# EAGLE schematic TeklaShieldThroughHole (EAGLE 5.10)
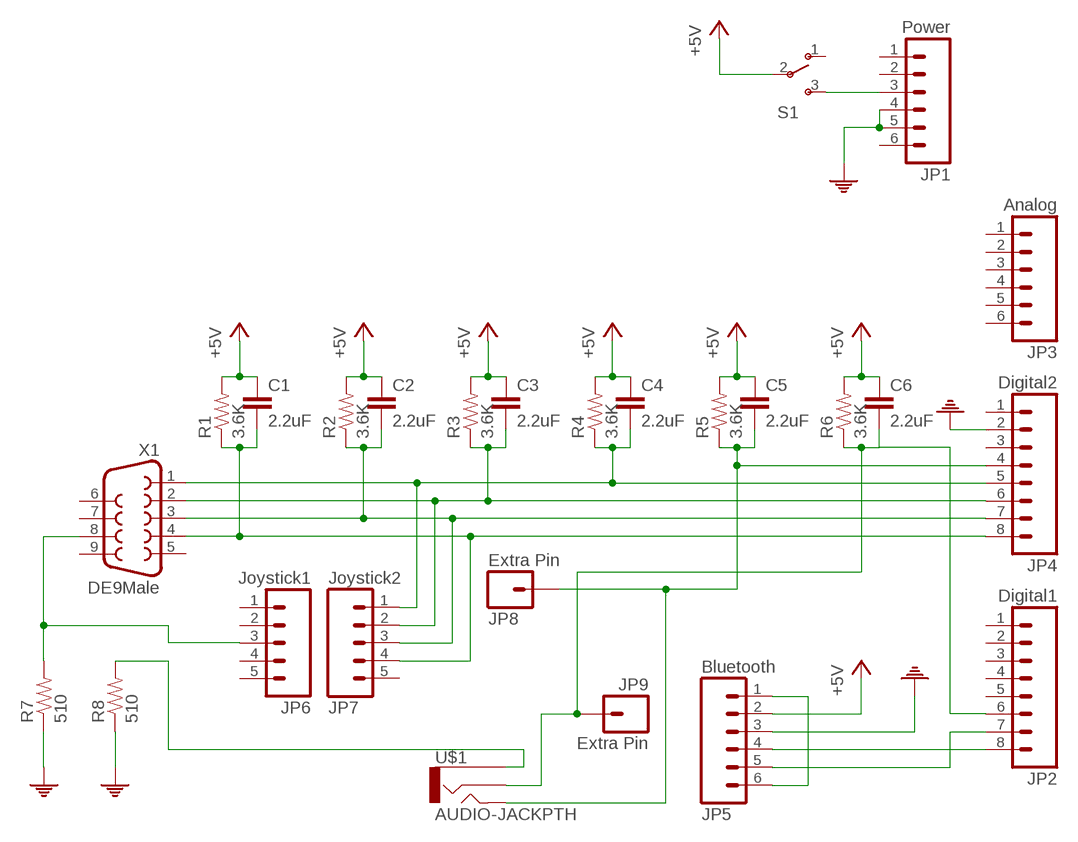
[diagram p0: schematic, sheet 1]

## Parts
C1  2.2uF  CAPPTH  [CAP-PTH-SMALL]
C2  2.2uF  CAPPTH  [CAP-PTH-SMALL]
C3  2.2uF  CAPPTH  [CAP-PTH-SMALL]
C4  2.2uF  CAPPTH  [CAP-PTH-SMALL]
C5  2.2uF  CAPPTH  [CAP-PTH-SMALL]
C6  2.2uF  CAPPTH  [CAP-PTH-SMALL]
JP1  Power  M06SIP  [1X06]
JP2  Digital1  M08  [1X08]
JP3  Analog  M06SIP  [1X06]
JP4  Digital2  M08  [1X08]
JP5  Bluetooth  M06SIP  [1X06]
JP6  Joystick1  M05  [1X05]
JP7  Joystick2  M05  [1X05]
JP8  Extra Pin  M01PTH  [1X01]
JP9  Extra Pin  M01PTH  [1X01]
R1  3.6K  RESISTORPTH1  [AXIAL-0.3]
R2  3.6K  RESISTORPTH1  [AXIAL-0.3]
R3  3.6K  RESISTORPTH1  [AXIAL-0.3]
R4  3.6K  RESISTORPTH1  [AXIAL-0.3]
R5  3.6K  RESISTORPTH1  [AXIAL-0.3]
R6  3.6K  RESISTORPTH1  [AXIAL-0.3]
R7  510  RESISTORPTH1  [AXIAL-0.3]
R8  510  RESISTORPTH1  [AXIAL-0.3]
S1  SWITCH-SPST  [SWITCH-SPST]
U$1  AUDIO-JACKPTH  [AUDIO-JACK]
X1  DE9Male  DB9  [DB9]

## Nets
E1: C5.2 JP4.4 JP8.1 R5.P$1 U$1.5
E2: C6.2 JP2.6 JP9.1 R6.P$1 U$1.2
ECMN: R8.P$2 U$1.1
GND: JP1.4 JP1.5 JP4.2 JP5.3 R7.P$1 R8.P$1
JCMN: JP6.3 R7.P$2 X1.8
N$1: JP2.8 JP5.4
N$2: JP2.7 JP5.5
N$3: JP1.3 S1.3(S)
N$4: JP5.1 JP5.6
S1: C4.2 JP4.5 JP7.1 R4.P$1 X1.1
S2: C3.2 JP4.6 JP7.2 R3.P$1 X1.2
S3: C2.2 JP4.7 JP7.3 R2.P$1 X1.3
S4: C1.2 JP4.8 JP7.4 R1.P$1 X1.4
VCC: C1.1 C2.1 C3.1 C4.1 C5.1 C6.1 JP5.2 R1.P$2 R2.P$2 R3.P$2 R4.P$2 R5.P$2 R6.P$2 S1.2(P) ; supply symbol labelled +5V
Unconnected: JP1.1 JP1.2 JP1.6 JP2.1 JP2.2 JP2.3 JP2.4 JP2.5 JP3.1 JP3.2 JP3.3 JP3.4 JP3.5 JP3.6 JP4.1 JP4.3 JP6.1 JP6.2 JP6.4 JP6.5 JP7.5 S1.1(O) X1.5 X1.6 X1.7 X1.9

## Library data of the parts
C1-C6 = SparkFun-3-2-07:CAP: Capacitor Standard 0603 ceramic capacitor, and 0.1" leaded capacitor.
JP1 JP3 JP5 = SparkFun-3-2-07:M06: Header 6 Standard 6-pin 0.1" header. Use with straight break away headers (SKU : PType-HD), right angle break away headers (PType-HD-RightAngle), swiss pins (PType-30F), machine pins (PType-MP), and female headers (PType-FH). Molex polarized connector foot print use with SKU : Con-Hdr with associated crimp pins and housings.
JP2 JP4 = SparkFun-3-2-07:M08: Header 8 Standard 8-pin 0.1" header. Use with straight break away headers (SKU : PType-HD), right angle break away headers (PType-HD-RightAngle), swiss pins (PType-30F), machine pins (PType-MP), and female headers (PType-FH). Molex polarized connector foot print use with SKU : Con-Hdr with associated crimp pins and housings.
JP6 JP7 = SparkFun-3-2-07:M05: Header 5 Standard 5-pin 0.1" header. Use with straight break away headers (SKU : PType-HD), right angle break away headers (PType-HD-RightAngle), swiss pins (PType-30F), machine pins (PType-MP), and female headers (PType-FH). Molex polarized connector foot print use with SKU : Con-Hdr with associated crimp pins and housings.
JP8 JP9 = SparkFun:M01: Header 1 Standard 1-pin 0.1" header. Use with straight break away headers (SKU : PRT-00116), right angle break away headers (PRT-00553), swiss pins (PRT-00743), machine pins (PRT-00117), and female headers (PRT-00115).
R1-R8 = SparkFun-3-2-07:RESISTOR: Resistor Basic schematic elements and footprints for 0603, 1206, and PTH 1/10th watt (small) resistors.
S1 = SparkFun-3-2-07:SWITCH-SPST: SPST Switch Simple slide switch. Spark Fun Electronics SKU : Comp-SW1
U$1 = SparkFun:AUDIO-JACK: 3.5mm Audio Jack Simple 3.5mm common PCB mount audio jack. SKU: PRT-08032
X1 = SparkFun-3-2-07:DB9: DB9 Connector Standard DB9 (D-Sub 9) serial connector. Can be used for CAN bus as well as RS485 and RS232. Footprint production proven. Spark Fun Electronics SKU : PType-DB9-PCB